# EAGLE design redbear (EAGLE 7.5.0)
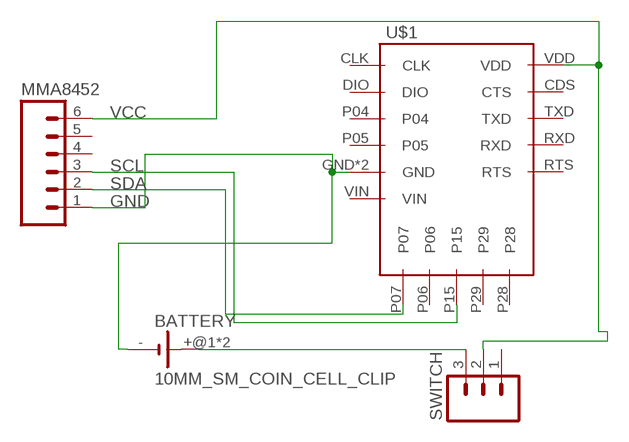
[diagram p0: schematic, sheet 1]

## Parts
BATTERY  10MM_SM_COIN_CELL_CLIP  [10MM_SM_COIN_CELL_CLIP]
MMA8452  M06NO_SILK_FEMALE_PTH  [1X06_NO_SILK]
SWITCH  M03PTH  [1X03]
U$1  REDBEAR_NANOBREAKOUT1  [BREAKOUT]

## Nets
GND: BATTERY.- MMA8452.1 U$1.GND U$1.GND1(GND)
N$1: BATTERY.+@1(+) BATTERY.+@2(+) SWITCH.3
SCL: MMA8452.3 U$1.P15
SDA: MMA8452.2 U$1.P07
VCC: MMA8452.6 SWITCH.2 U$1.VDD
Unconnected: MMA8452.4 MMA8452.5 SWITCH.1 U$1.CDS(CTS) U$1.CLK U$1.DIO U$1.P04 U$1.P05 U$1.P06 U$1.P28 U$1.P29 U$1.RTS U$1.RXD U$1.TXD U$1.VIN

## Library data of the parts
BATTERY = battery:10MM_SM_COIN_CELL_CLIP: Battery cell clip for CR927 Source: KEYSTONE ELECTRONICS CORP. www.keyelco.com, ASTORIA, N.Y. 11105-2017 PART ANME 10mm SM COIN CELl CLIP DWG NO. 3030
MMA8452 = SparkFun-Connectors:M06: Header 6 Standard 6-pin 0.1" header. Use with straight break away headers (SKU : PRT-00116), right angle break away headers (PRT-00553), swiss pins (PRT-00743), machine pins (PRT-00117), and female headers (PRT-00115). Molex polarized connector foot print use with SKU : PRT-08094 with associated crimp pins and housings. NOTES ON THE VARIANTS LOCK and LOCK_LONGPADS... This footprint was designed to help hold the alignment of a through-hole component (i.e. 6-pin header) while soldering it into place. You may notice that each hole has been shifted either up or down by 0.005 of an inch from it's more standard position (which is a perfectly straight line). This slight alteration caused the pins (the squares in the middle) to touch the edges of the holes. Because they are alternating, it causes a "brace" to hold the component in place. 0.005 has proven to be the perfect amount of "off-center" position when using our standard breakaway headers. Although looks a little odd when you look at the bare footprint, once you have a header in there, the alteration is very hard to notice. Also,if you push a header all the way into place, it is covered up entirely on the bottom side. This idea of altering the position of holes to aid alignment will be further integrated into the Sparkfun Library for other footprints. It can help hold any component with 3 or more connection pins.; PROD_ID: CONN-08437
SWITCH = SparkFun-Connectors:M03: Header 3 Standard 3-pin 0.1" header. Use with straight break away headers (SKU : PRT-00116), right angle break away headers (PRT-00553), swiss pins (PRT-00743), machine pins (PRT-00117), and female headers (PRT-00115). Molex polarized connector foot print use with SKU : PRT-08232 with associated crimp pins and housings.
U$1 = redbear_nano:REDBEAR_NANO

## Board
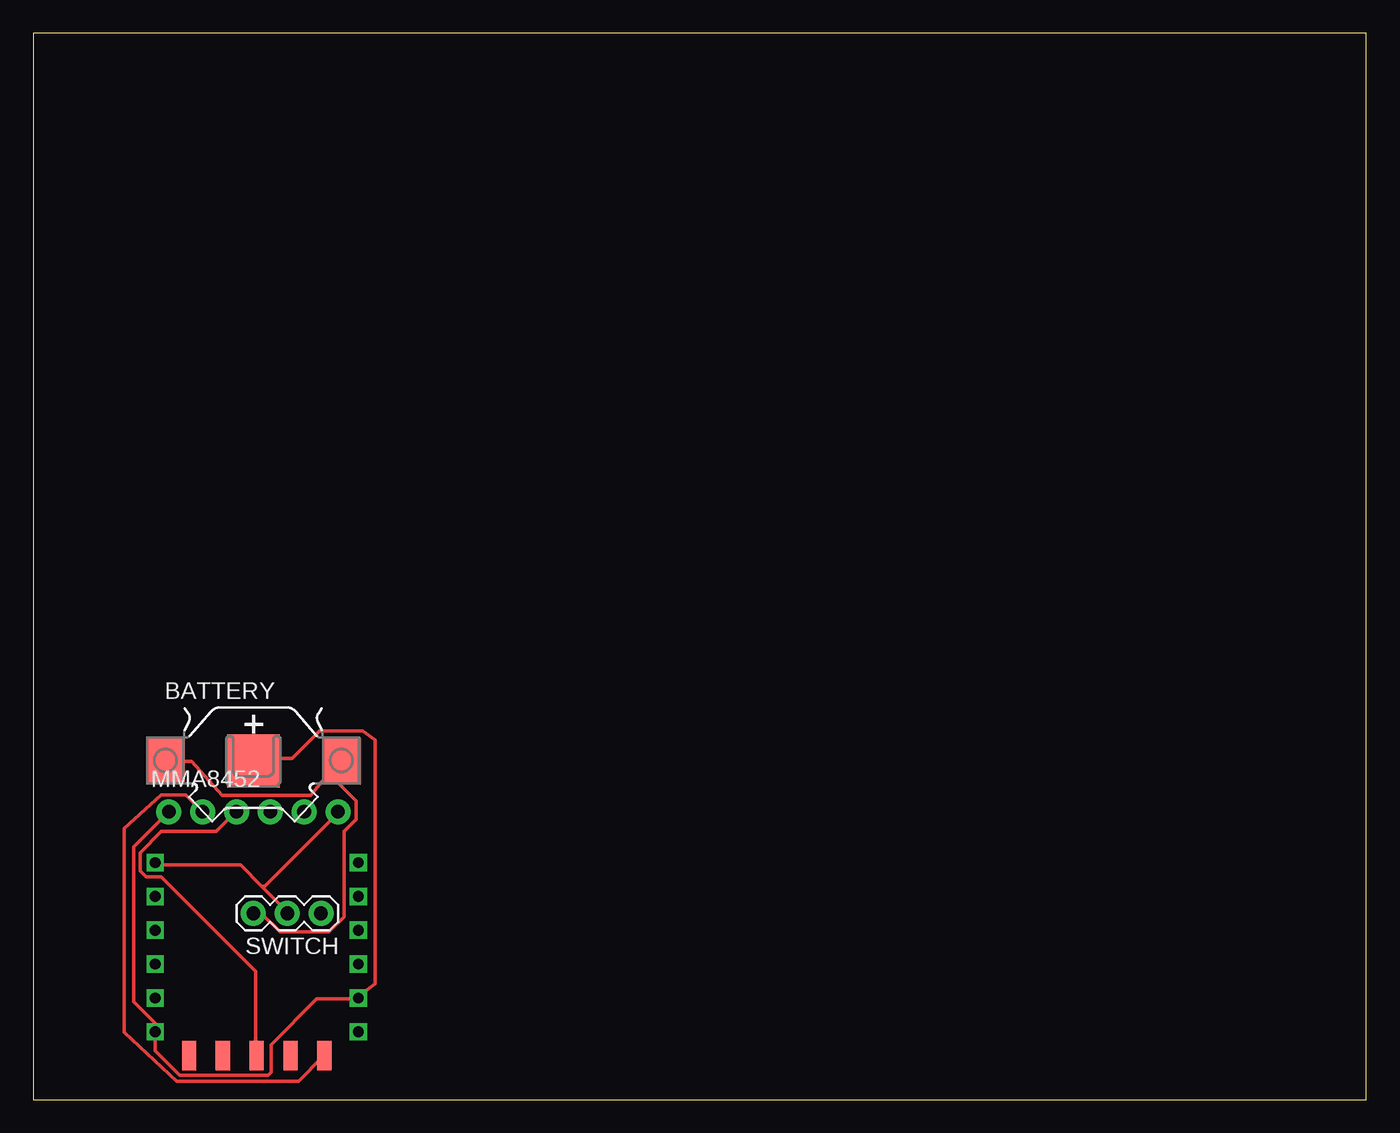
[diagram p1: board, top side]

Size 100 x 80 mm. Coordinates in mm from the lower left corner, seen from the top.
Outline: 0,0 100,0 100,80 0,80 0,0
Copper layers (1*16): Top 0.035mm / dielectric 1.5mm / Bottom 0.035mm
Design rules "default": minimum track width 10mil, minimum drill 24mil, track to track 8mil, track to pad 8mil, pad to pad 8mil, via to via 8mil, smd to smd 8mil, copper to edge 40mil, drill to drill 8mil, minimum pad ring 10mil, minimum via ring 8mil, stop-mask expansion 4mil, vias tented up to drill 0mil, thermal gap 10mil

### Footprints (pad centres in the part's own frame; a part is rotated, then mirrored left to right if it is on the bottom)
10MM_SM_COIN_CELL_CLIP = smd 2.9 x 3.5: +@1 -6.6,0; +@2 6.6,0 | smd 3.96 x 3.96: - 0,0
1X06_NO_SILK = drill 1.016 pad 1.88: 1 0,0; 2 2.54,0; 3 5.08,0; 4 7.62,0; 5 10.16,0; 6 12.7,0
1X03 = drill 1.016 pad 1.88: 1 0,0; 2 2.54,0; 3 5.08,0
BREAKOUT = drill 0.8 square: CDS -2.286,7.62; CLK 12.954,10.16; DIO 12.954,7.62; GND -2.286,-2.54; GND1 12.954,0; P04 12.954,5.08; P05 12.954,2.54; RTS -2.286,0; RXD -2.286,2.54; TXD -2.286,5.08; VDD -2.286,10.16; VIN 12.954,-2.54 | smd 1.067 x 2.184: P06 7.874,-4.318; P07 10.414,-4.318; P15 5.334,-4.318; P28 0.254,-4.318; P29 2.794,-4.318

### Placement (x,y rotation side)
BATTERY  16.51,25.4 0 top
MMA8452  10.16,21.59 0 top
SWITCH  21.59,13.97 180 top
U$1  11.43,7.62 0 top

### Tracks (layer width: path | path; a pad name or v marks a point on that pad's centre or on a via)
GND
  Top 0.254: MMA8452.1 7.54,18.97 7.54,7.32 9.14,5.71 U$1.GND 9.14,3.66 10.97,1.83 17.6,1.83 17.83,2.06 17.83,4.12 21.26,7.54 24.23,7.54 U$1.GND1 24.46,7.77 25.63,8.69 25.63,26.98 24.69,27.66 21.49,27.66 19.43,25.6 16.69,25.6 BATTERY.-
N$1
  Top 0.254: 22.17,24.46 23.09,25.38 BATTERY.+@2 22.17,24.46 | 22.17,24.46 20.8,22.84 14.17,22.84 11.89,25.38 10.06,25.38 BATTERY.+@1 | 22.17,24.46 24.23,22.4 24.23,21.03 23.32,20.12 23.32,13.72 22.17,12.57 18.52,12.57 17.14,13.95 16.69,13.95 SWITCH.3
SCL
  Top 0.254: U$1.P15 16.69,3.43 16.69,9.6 9.6,16.69 8.46,16.69 8,17.14 8,18.52 9.6,20.12 13.72,20.12 15.09,21.49 MMA8452.3
SDA
  Top 0.254: MMA8452.2 11.43,22.86 9.6,22.86 6.83,20.34 6.83,5.03 10.74,1.37 19.89,1.37 21.72,3.2 U$1.P07
VCC
  Top 0.254: 17.14,16 18.97,14.17 SWITCH.2 | 17.14,16 15.54,17.6 9.14,17.6 U$1.VDD | 17.14,16 17.37,16 22.86,21.49 MMA8452.6